# Altium schematic sheet Main.SchDoc
size B
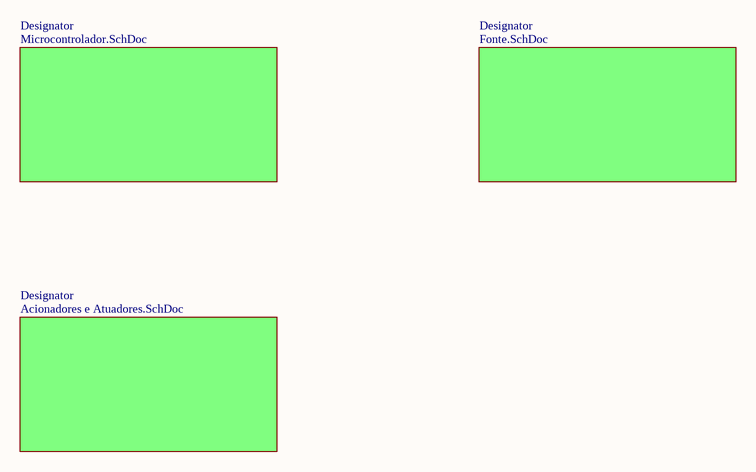
[diagram p0: Main.SchDoc]

## Sub-sheets
Designator = Microcontrolador.SchDoc: no entries
Designator = Fonte.SchDoc: no entries
Designator = Acionadores e Atuadores.SchDoc: no entries